# EAGLE design fabkit02 (EAGLE 6.5.0)
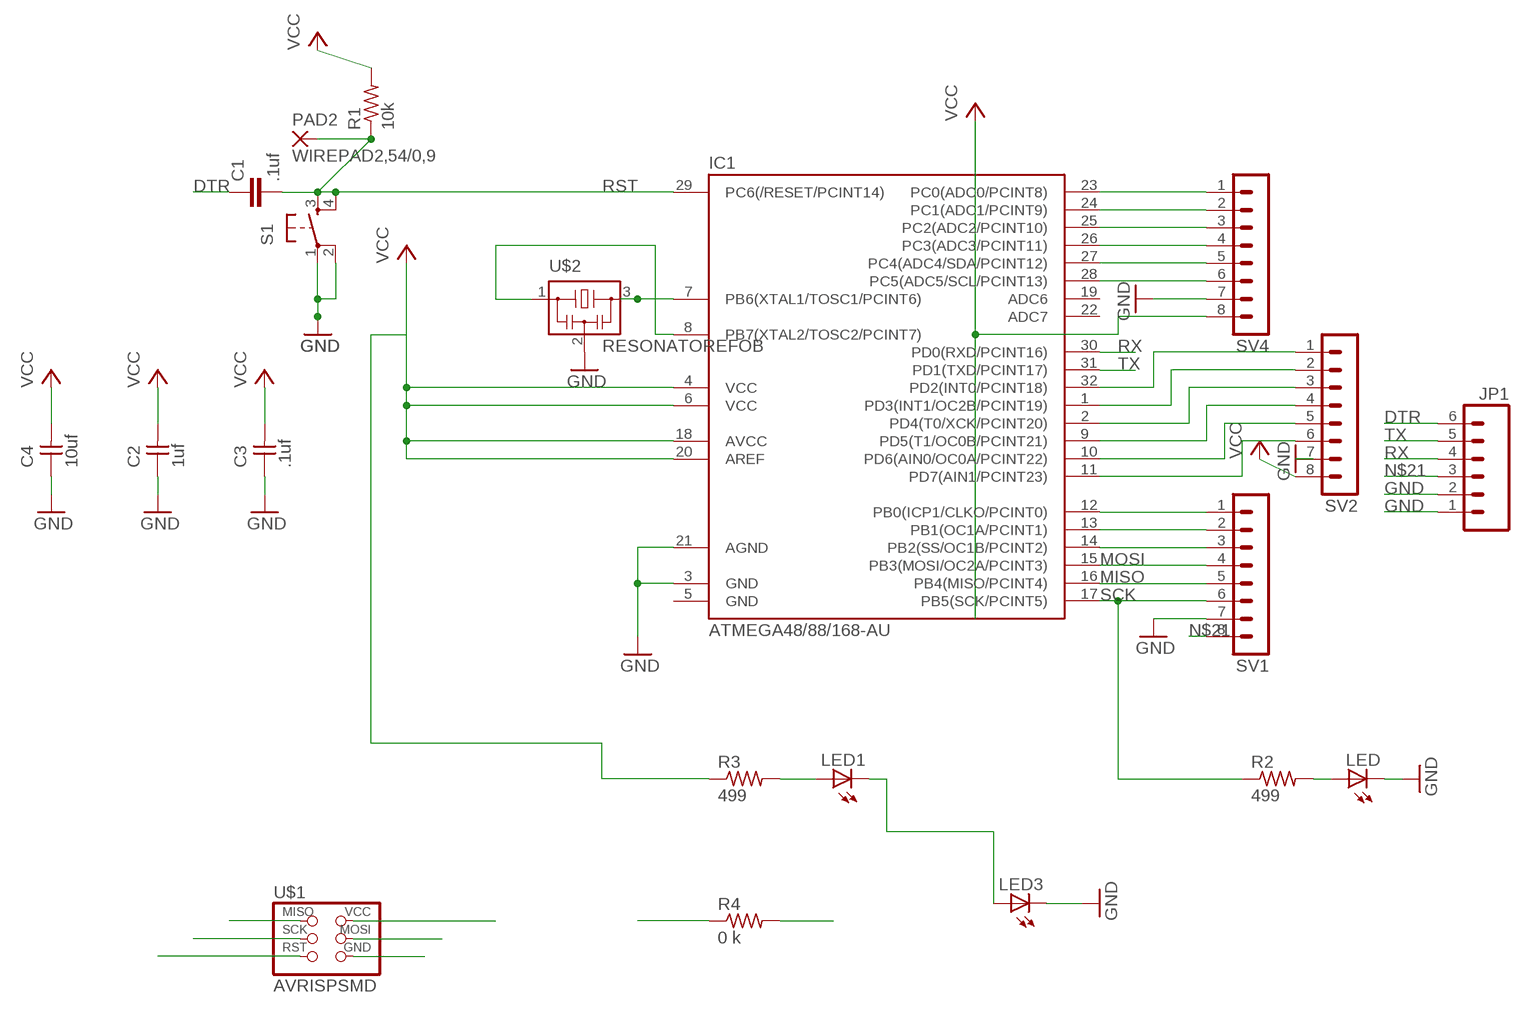
[diagram p0: schematic, sheet 1]

## Parts
C1  .1uf  C-EUC1206  [C1206]
C2  1uf  UNPOLARIZED_CAPACITOR1206  [1206]
C3  .1uf  UNPOLARIZED_CAPACITOR1206  [1206]
C4  10uf  UNPOLARIZED_CAPACITOR1206  [1206]
IC1  ATMEGA48/88/168-AU  [TQFP32-08]
JP1  M06SMD  [1X06-SMD]
LED  LED1206  [1206]
LED1  LED1206  [1206]
LED3  LED1206  [1206]
PAD2  WIREPAD2,54/0,9  [2,54/0,9]
R1  10k  RESISTOR1206  [1206]
R2  499  RESISTOR1206  [1206]
R3  499  RESISTOR1206  [1206]
R4  0 k  RESISTOR1206  [1206]
S1  6MM_SWITCH6MM_SWITCH  [6MM_SWITCH]
SV1  MA08-1  [MA08-1]
SV2  MA08-1  [MA08-1]
SV4  MA08-1  [MA08-1]
U$1  AVRISPSMD  [2X03SMD]
U$2  RESONATOREFOB  [EFOBM]

## Nets
DTR: C1.1 JP1.6
GND: C2.1 C3.1 C4.1 IC1.3(GND) IC1.21(AGND) JP1.1 JP1.2 LED3.2(C) LED.2(C) S1.1(P) S1.2(P1) SV1.7 SV2.7 SV4.7 U$1.6(GND) U$2.2
MISO: IC1.16(PB4(MISO/PCINT4)) SV1.5 U$1.1(MISO)
MOSI: IC1.15(PB3(MOSI/OC2A/PCINT3)) R4.1 R4.2 SV1.4 U$1.4(MOSI)
N$1: IC1.8(PB7(XTAL2/TOSC2/PCINT7)) U$2.1
N$2: IC1.12(PB0(ICP1/CLKO/PCINT0)) SV1.1
N$3: IC1.23(PC0(ADC0/PCINT8)) SV4.1
N$4: IC1.24(PC1(ADC1/PCINT9)) SV4.2
N$5: IC1.25(PC2(ADC2/PCINT10)) SV4.3
N$6: IC1.26(PC3(ADC3/PCINT11)) SV4.4
N$7: IC1.27(PC4(ADC4/SDA/PCINT12)) SV4.5
N$8: IC1.28(PC5(ADC5/SCL/PCINT13)) SV4.6
N$9: IC1.7(PB6(XTAL1/TOSC1/PCINT6)) U$2.3
N$10: IC1.32(PD2(INT0/PCINT18)) SV2.1
N$11: IC1.1(PD3(INT1/OC2B/PCINT19)) SV2.2
N$12: IC1.2(PD4(T0/XCK/PCINT20)) SV2.3
N$13: IC1.9(PD5(T1/OC0B/PCINT21)) SV2.4
N$14: IC1.10(PD6(AIN0/OC0A/PCINT22)) SV2.5
N$15: IC1.11(PD7(AIN1/PCINT23)) SV2.6
N$16: LED1.1(A) R3.2
N$17: IC1.13(PB1(OC1A/PCINT1)) SV1.2
N$18: IC1.14(PB2(SS/OC1B/PCINT2)) SV1.3
N$20: LED1.2(C) LED3.1(A)
N$21: C2.2 C3.2 C4.2 IC1.4(VCC) IC1.6(VCC) IC1.18(AVCC) IC1.20(AREF) JP1.3 R1.2 R3.1 SV1.8 SV2.8 SV4.8 U$1.2(VCC) ; supply symbol labelled VCC
N$23: LED.1(A) R2.2
RST: C1.2 IC1.29(PC6(/RESET/PCINT14)) PAD2.1(P) R1.1 S1.3(S) S1.4(S1) U$1.5(RST)
RX: IC1.30(PD0(RXD/PCINT16)) JP1.4
SCK: IC1.17(PB5(SCK/PCINT5)) R2.1 SV1.6 U$1.3(SCK)
TX: IC1.31(PD1(TXD/PCINT17)) JP1.5
Unconnected: IC1.19(ADC6) IC1.22(ADC7)

## Power pins joined to a net without a drawn wire
GND: IC1.5(GND)

## Library data of the parts
C1 = rcl:C-EU: CAPACITOR, European symbol
C2-C4 = ng:UNPOLARIZED_CAPACITOR: unpolarized_capacitor
IC1 = atmega8:ATMEGA48/88/168
JP1 = SparkFun:M06: Header 6 Standard 6-pin 0.1" header. Use with straight break away headers (SKU : PRT-00116), right angle break away headers (PRT-00553), swiss pins (PRT-00743), machine pins (PRT-00117), and female headers (PRT-00115). Molex polarized connector foot print use with SKU : PRT-08094 with associated crimp pins and housings. NOTES ON THE VARIANTS LOCK and LOCK_LONGPADS... This footprint was designed to help hold the alignment of a through-hole component (i.e. 6-pin header) while soldering it into place. You may notice that each hole has been shifted either up or down by 0.005 of an inch from it's more standard position (which is a perfectly straight line). This slight alteration caused the pins (the squares in the middle) to touch the edges of the holes. Because they are alternating, it causes a "brace" to hold the component in place. 0.005 has proven to be the perfect amount of "off-center" position when using our standard breakaway headers. Although looks a little odd when you look at the bare footprint, once you have a header in there, the alteration is very hard to notice. Also, if you push a header all the way into place, it is covered up entirely on the bottom side. This idea of altering the position of holes to aid alignment will be further integrated into the Sparkfun Library for other footprints. It can help hold any component with 3 or more connection pins.
LED LED1 LED3 = ng:LED
PAD2 = wirepad:WIREPAD: Wire PAD connect wire on PCB
R1-R3 = ng:RESISTOR
R4 = 01_FAB_Hello:RESISTOR
S1 = ng:6MM_SWITCH: OMRON SWITCH
SV1 SV2 SV4 = con-lstb:MA08-1: PIN HEADER
U$1 = 01_fab:AVRISP
U$2 = fab:RESONATOR

## Board
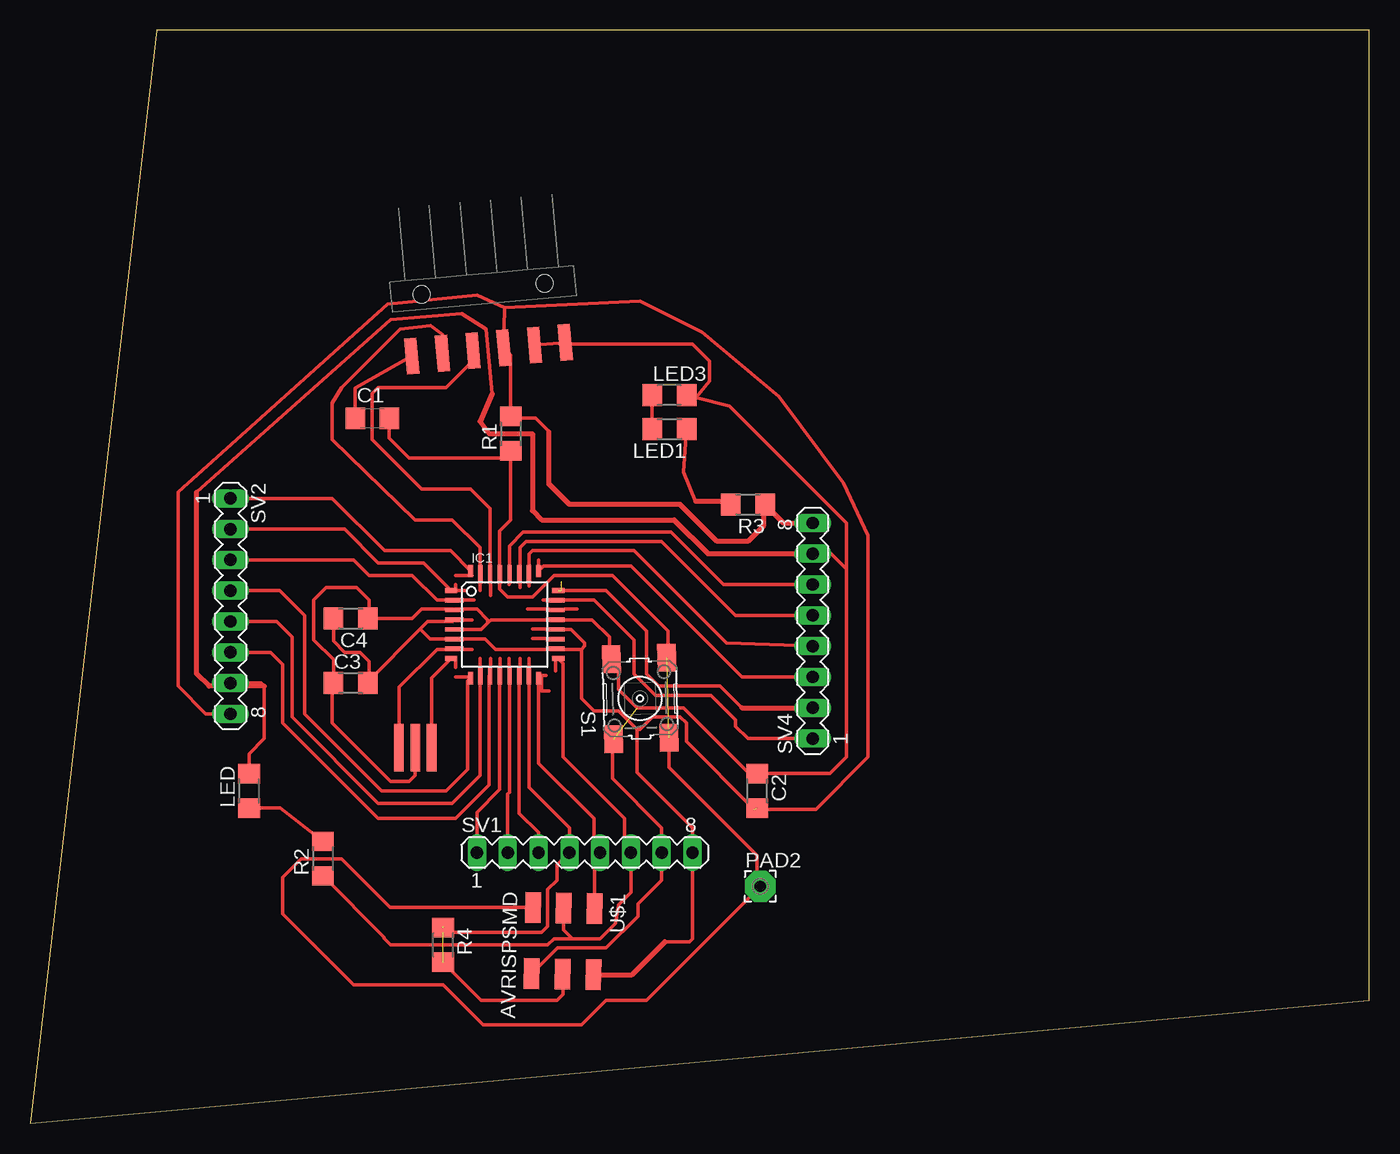
[diagram p1: board, top side]
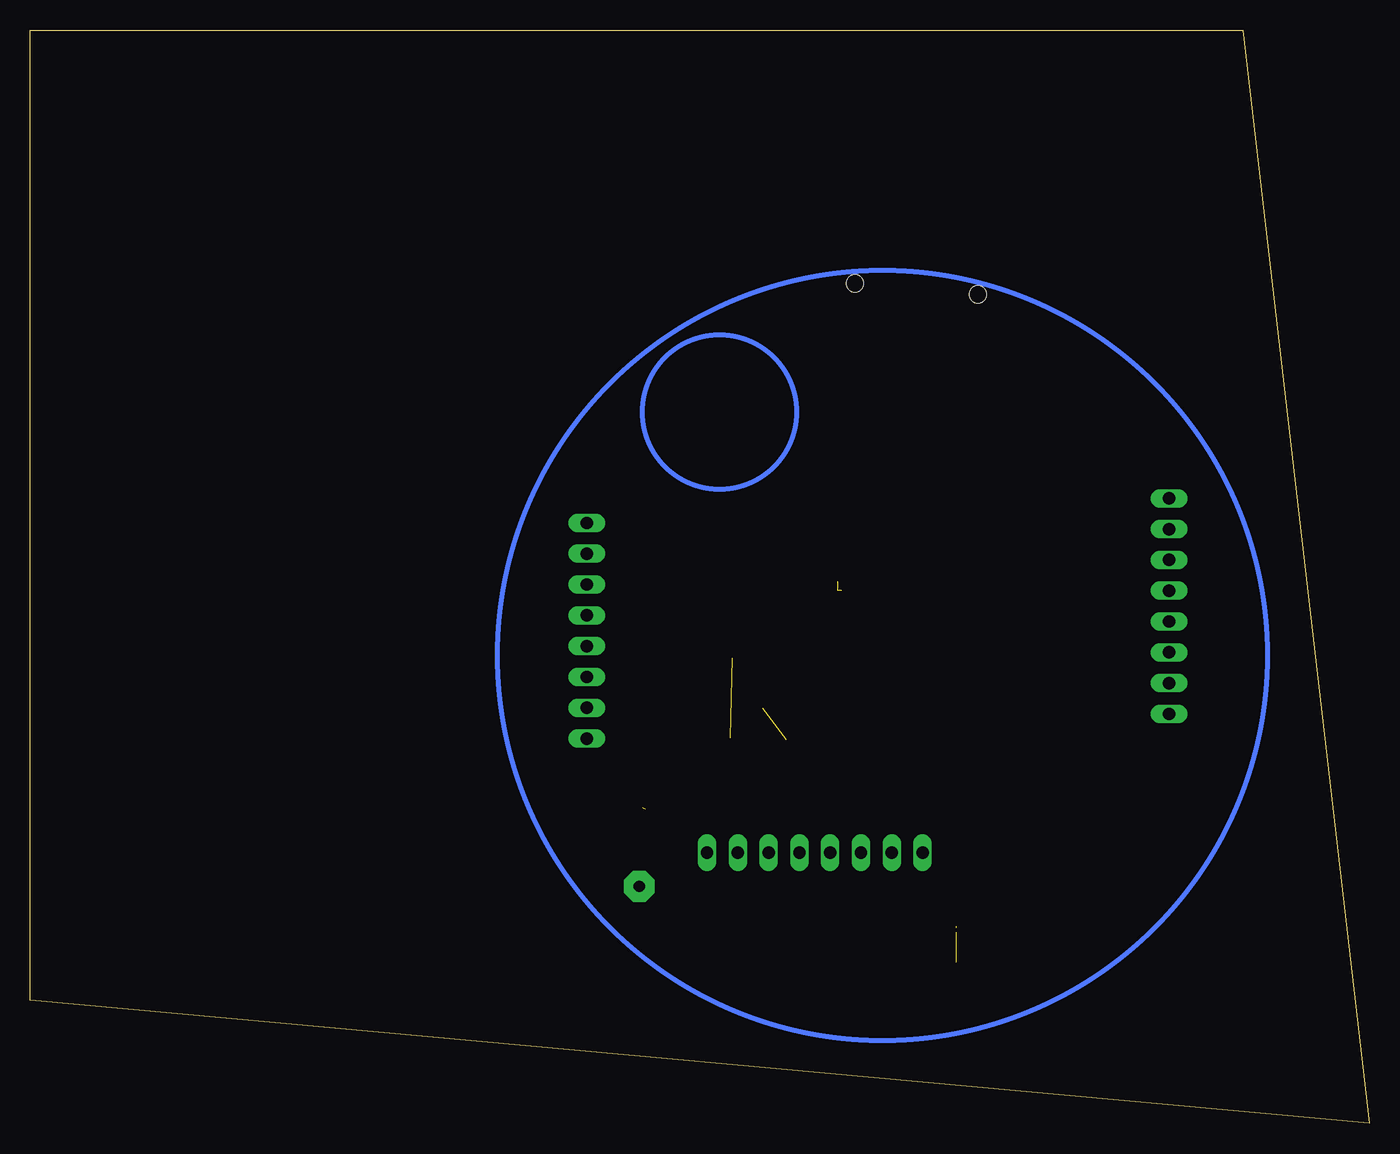
[diagram p2: board, bottom side, seen from below]

Size 110.41 x 90.16 mm. Coordinates in mm from the lower left corner, seen from the top.
Outline: 0,0 110.41,10.16 110.41,90.16 10.41,90.16 0,0
Copper layers (1*16): Top 0.035mm / dielectric 1.5mm / Bottom 0.035mm
Design rules "default": minimum track width 10mil, minimum drill 24mil, track to track 8mil, track to pad 8mil, pad to pad 8mil, via to via 8mil, smd to smd 8mil, copper to edge 40mil, drill to drill 8mil, minimum pad ring 10mil, minimum via ring 8mil, stop-mask expansion 4mil, vias tented up to drill 0mil, thermal gap 10mil

### Footprints (pad centres in the part's own frame; a part is rotated, then mirrored left to right if it is on the bottom)
C1206 = smd 1.6 x 1.8: 1 -1.4,0; 2 1.4,0
1206 = smd 1.6 x 1.803: 1 -1.422,0; 2 1.422,0
TQFP32-08 = smd 1.016 x 0.406: 1 -4.42,2.8; 8 -4.42,-2.8; 17 4.42,-2.8; 24 4.42,2.8 | smd 1.524 x 0.356: 2 -4.166,2; 3 -4.166,1.2; 4 -4.166,0.4; 5 -4.166,-0.4; 6 -4.166,-1.2; 7 -4.166,-2; 18 4.166,-2; 19 4.166,-1.2; 20 4.166,-0.4; 21 4.166,0.4; 22 4.166,1.2; 23 4.166,2 | smd 0.406 x 1.016: 9 -2.8,-4.42; 16 2.8,-4.42; 25 2.8,4.42; 32 -2.8,4.42 | smd 0.356 x 1.524: 10 -2,-4.166; 11 -1.2,-4.166; 12 -0.4,-4.166; 13 0.4,-4.166; 14 1.2,-4.166; 15 2,-4.166; 26 2,4.166; 27 1.2,4.166; 28 0.4,4.166; 29 -0.4,4.166; 30 -1.2,4.166; 31 -2,4.166
1X06-SMD = smd 1 x 3: 1 -6.35,5; 2 -3.81,5; 3 -1.27,5; 4 1.27,5; 5 3.81,5; 6 6.35,5 | hole 1.4: -5.08,0; 5.08,0
2,54/0,9 = drill 0.914 pad 2.54 octagon: 1 0,0
6MM_SWITCH = smd 2.286 x 1.524: 1 -3.302,2.286; 2 3.302,2.286; 3 -3.302,-2.286; 4 3.302,-2.286
MA08-1 = drill 1.016 long: 1 -8.89,0; 2 -6.35,0; 3 -3.81,0; 4 -1.27,0; 5 1.27,0; 6 3.81,0; 7 6.35,0; 8 8.89,0
2X03SMD = smd 2.54 x 1.27: 1 -2.54,2.54; 2 2.92,2.54; 3 -2.54,0; 4 2.92,0; 5 -2.54,-2.54; 6 2.92,-2.54
EFOBM = smd 0.8 x 3.9: 1 -1.35,0; 2 0,0; 3 1.35,0

### Placement (x,y rotation side)
C1  28.19,58.17 0 top
C2  59.94,27.43 270 top
C3  26.42,36.32 0 top
C4  26.42,41.66 180 top
IC1  39.12,41.15 0 top
JP1  37.34,68.83 185.1 top
LED  18.03,27.43 90 top
LED1  52.7,57.28 180 top
LED3  52.7,60.07 0 top
PAD2  60.2,19.56 0 top
R1  39.62,56.9 90 top
R2  24.13,21.84 90 top
R3  59.18,51.05 180 top
R4  34.04,14.73 270 top
S1  50.29,35.05 91.5 top
SV1  45.72,22.35 0 top
SV2  16.51,42.67 270 top
SV4  64.52,40.64 90 top
U$1  43.94,15.24 269 top
U$2  31.75,30.99 180 top

### Tracks (layer width: path | path; a pad name or v marks a point on that pad's centre or on a via)
DTR
  Top 0.305: C1.1 26.79,60.66 JP1.6
GND  (1 unrouted)
  Top 0.305: JP1.2 JP1.1 44.26,64.26 54.61,64.26 56.01,62.86 56.01,61.21 54.88,59.88 | U$2.2 31.75,28.7 31.24,28.19 29.72,28.19 24.89,33.02 24.89,36.22 C3.1 24.99,38.25 23.37,39.88 23.37,43.18 24.38,44.2 26.92,44.2 27.94,43.18 27.94,41.76 C4.1 31.5,41.66 32.26,42.42 34.88,42.42 IC1.3 35.02,42.42 36.83,42.42 37.72,41.53 37.72,41.27 | LED.2 18.03,30.48 19.3,31.75 19.3,36.07 19.05,36.32 SV2.7 | 37.72,41.27 37.99,41.55 IC1.21 46.34,41.55 47.75,40.13 47.75,38.46 S1.2 48.51,37.7 48.51,35.81 50.04,34.29 53.85,34.29 59.28,28.85 C2.1 65.94,28.85 67.31,30.23 67.31,45.72 | 37.72,41.27 37.19,40.75 IC1.5 | S1.1 48.01,31.6 48.01,28.45 52.07,24.38 SV1.7 52.07,20.07 50.12,18.12 50.12,17.1 47.5,14.48 43.47,14.48 U$1.6 | 13.72,52.07 29.72,66.29 35.56,66.8 37.59,65.53 38.1,60.2 | 67.31,45.72 66.04,46.99 SV4.7 | 67.31,45.72 67.31,49.53 57.66,59.18 54.88,59.88 | 54.88,59.88 LED3.2
  Top 0.406: 19.3,36.07 14.73,36.07 13.72,37.08 13.72,52.07 | 38.1,60.2 37.08,57.91 37.85,56.9 41.4,56.9 41.4,50.55 42.16,49.78 53.09,49.78 55.88,46.99 SV4.7
MISO
  Top 0.305: IC1.16 41.92,29.71 46.48,25.15 46.48,22.86 SV1.5 46.53,21.89 U$1.1
MOSI  (2 unrouted)
  Top 0.305: IC1.15 41.12,27.72 44.45,24.38 SV1.4 43.43,21.34 43.43,20.07 42.67,19.3 42.67,16.26 42.16,15.75 34.04,15.75 34.04,16.26 | 43.89,11.63 U$1.4 43.94,12.27 43.94,10.67 43.43,10.16 37.19,10.16 R4.2
N$1
  Top 0.305: U$2.1 33.1,36.75 IC1.8
N$2
  Top 0.305: IC1.12 38.72,27.54 36.83,25.65 SV1.1
N$3
  Top 0.305: IC1.23 43.31,43.18 46.48,43.18 49.78,39.88 49.78,37.08 51.56,35.31 56.13,35.31 58.17,33.27 58.17,32.77 59.18,31.75 SV4.1
N$4  (2 unrouted)
  Top 0.305: IC1.24 47.5,43.94 50.8,40.64 50.8,37.08 51.82,36.07 56.9,36.07 58.67,34.29
  Top 0.406: 58.67,34.29 SV4.2
N$5
  Top 0.305: SV4.3 58.67,36.83 49.53,45.97 42.32,45.97 IC1.25
N$6
  Top 0.305: IC1.26 41.12,46.96 41.4,47.24 49.78,47.24 57.4,39.62 SV4.4
N$7
  Top 0.305: IC1.27 40.39,45.38 40.39,47.5 40.89,48.01 52.07,48.01 58.17,41.91 SV4.5
N$8
  Top 0.305: SV4.6 57.15,44.45 52.83,48.77 40.64,48.77 39.52,47.64 IC1.28
N$9
  Top 0.305: U$2.3 30.4,35.99 33.53,39.12 34.92,39.12 IC1.7
N$10
  Top 0.305: SV2.1 24.89,51.56 29.21,47.24 34.64,47.24 IC1.32
N$11
  Top 0.305: SV2.2 25.91,49.02 28.7,46.23 32.42,46.23 IC1.1
N$12
  Top 0.305: SV2.3 26.67,46.48 27.94,45.21 31.5,45.21 33.53,43.18 34.92,43.18 IC1.2
N$13
  Top 0.305: SV2.4 20.57,43.94 22.61,41.91 22.61,33.78 28.96,27.43 34.29,27.43 36.07,29.21 36.07,36.48 IC1.9
N$14
  Top 0.305: SV2.5 20.32,41.4 21.59,40.13 21.59,33.53 28.7,26.42 34.8,26.42 37.08,28.7 37.08,36.95 IC1.10
N$15
  Top 0.305: SV2.6 19.81,38.86 20.83,37.85 20.83,33.02 28.7,25.15 35.05,25.15 37.85,27.94 37.85,36.91 IC1.11
N$16
  Top 0.305: 54.86,51.31 53.85,53.72 LED1.1
  Top 0.406: R3.2 57.51,51.31 54.86,51.31
N$17
  Top 0.305: IC1.13 39.52,27.32 39.37,27.18 SV1.2
N$18
  Top 0.305: IC1.14 40.32,25.58 41.91,23.99 SV1.3
N$20
  Top 0.305: LED3.1 LED1.2
N$21  (1 unrouted)
  Top 0.305: 32.13,40.77 27.84,36.47 C3.2 27.94,36.42 27.94,38.1 27.18,38.86 25.91,38.86 24.99,39.78 C4.2 | 32.13,40.77 32.77,41.4 34.8,41.4 IC1.4 | 32.13,40.77 32.95,39.95 IC1.6 37.52,39.95 38.35,39.12 43.25,39.12 IC1.18 43.31,39.12 45.47,39.12 | 16.26,33.78 SV2.8 14.48,33.78 12.19,36.07 12.19,52.07 29.46,67.56 36.83,68.33 39.12,67.31 | 45.47,39.12 45.72,39.37 45.72,39.62 44.6,40.75 IC1.20 | 45.47,39.12 45.47,35.05 46.48,34.04 48.51,34.04 50.04,32.51 | 50.04,32.51 50.04,28.96 54.61,24.38 SV1.8 54.61,15.24 54.36,14.99 52.32,14.99 | 42.77,57.05 41.66,58.17 39.78,58.17 R1.2 39.62,63.39 JP1.3 39.12,67.31 | 50.04,32.51 50.29,32.51 51.31,33.53 53.59,33.53 54.1,33.02 54.1,31.5 59.69,25.91 64.77,25.91 69.09,30.23 69.09,48.51 67.06,52.83 61.72,59.94 55.37,65.28 50.29,67.82 39.12,67.31
  Top 0.406: SV4.8 62.13,49.53 R3.1 60.45,50.9 60.45,49.28 59.18,48.01 56.64,48.01 53.59,51.05 44.45,51.05 42.77,52.73 42.77,57.05 | U$1.2 49.61,12.28 52.32,14.99
N$23
  Top 0.305: LED.1 20.62,26.01 R2.2
N$42
  Top 0.305: 42.93,40.77 41.4,40.77
N$43
  Top 0.305: 43.05,40 41.4,40
N$44
  Top 0.305: 43.31,38.35 43.31,37.34
N$45
  Top 0.305: 41.91,36.96 42.04,36.96 42.16,36.96 | 42.16,36.96 42.16,35.69 42.8,35.69 | 42.16,36.96 42.55,36.96
N$46
  Top 0.305: 41.15,37.59 41.15,38.35
N$47
  Top 0.305: 40.39,37.47 40.39,38.35
N$48
  Top 0.305: 39.5,37.34 39.5,38.35
N$49
  Top 0.305: 38.73,37.34 38.73,38.35
N$50
  Top 0.305: 37.97,37.21 37.97,38.35
N$51
  Top 0.305: 37.08,37.34 37.08,38.35
N$52
  Top 0.305: 36.32,36.83 35.05,36.83
N$53
  Top 0.305: 35.05,38.35 35.05,37.59
N$54
  Top 0.305: 35.56,39.12 36.45,39.12
N$55
  Top 0.305: 35.43,41.53 36.45,41.53
N$56
  Top 0.305: 35.31,43.18 36.58,43.18
N$57
  Top 0.305: 35.05,44.45 35.05,43.94 35.94,43.94
N$58
  Top 0.305: 36.45,45.21 35.05,45.21
N$59
  Top 0.305: 37.08,45.21 37.08,43.94
N$60
  Top 0.305: 37.97,45.21 37.97,43.56
N$61
  Top 0.305: 39.5,45.08 39.5,44.45
N$62
  Top 0.305: 40.39,45.08 40.39,44.2
N$63
  Top 0.305: 41.15,45.08 41.15,44.32
N$64
  Top 0.305: 41.91,45.72 41.91,46.48
N$65
  Top 0.305: 44.07,42.42 45.09,42.42
N$66
  Top 0.305: 42.8,42.42 41.02,42.42
N$67
  Top 0.305: 42.93,43.18 42.29,43.18
RST  (1 unrouted)
  Top 0.305: 39.62,54.86 39.62,49.78 38.72,48.88 IC1.29 38.72,44.09 39.37,43.43 41.4,43.43 43.18,45.21 48.01,45.21 52.58,40.64 52.58,38.5 S1.4 | 39.62,54.86 R1.1 | C1.2 29.59,56.51 31.24,54.86 39.62,54.86 | U$1.5 29.67,17.82 25.65,21.84 22.35,21.84 20.83,20.32 20.83,17.27 26.67,11.43 34.04,11.43 37.34,8.13 45.47,8.13 47.5,10.16 50.8,10.16 PAD2.1 59.94,19.81 59.94,22.1 52.66,29.38 S1.3
RX
  Top 0.305: IC1.30 37.92,50.73 36.32,52.32 32.26,52.32 28.19,56.39 28.19,60.2 28.7,60.71 34.29,60.71 36.83,63.25 36.83,63.43 JP1.4
SCK
  Top 0.305: IC1.17 43.94,37.94 43.94,30.23 49.02,25.15 49.02,22.86 SV1.6 49.53,19.05 48.51,18.03 48.26,16.51 46.99,15.24 44.7,15.24 | 44.7,15.24 44.58,15.37 | 44.58,15.37 43.99,15.96 U$1.3 | R2.1 29.19,15.37 29.19,15.27 29.72,14.73 42.67,14.73 43.18,15.24 44.45,15.24 | 44.58,15.37 44.45,15.24 | 44.45,15.24 44.7,15.24
TX
  Top 0.305: JP1.5 33.99,65.07 33.02,65.79 30.48,65.53 25.65,60.71 24.89,59.44 24.89,56.39 31.75,49.78 34.8,49.78 37.08,47.5 37.08,45.35 IC1.31
(copper drawn outside any net)
  shapes: Bottom circle x2